# Altium schematic sheet Alimentacion.SchDoc
size A4; SheetNumber: 2
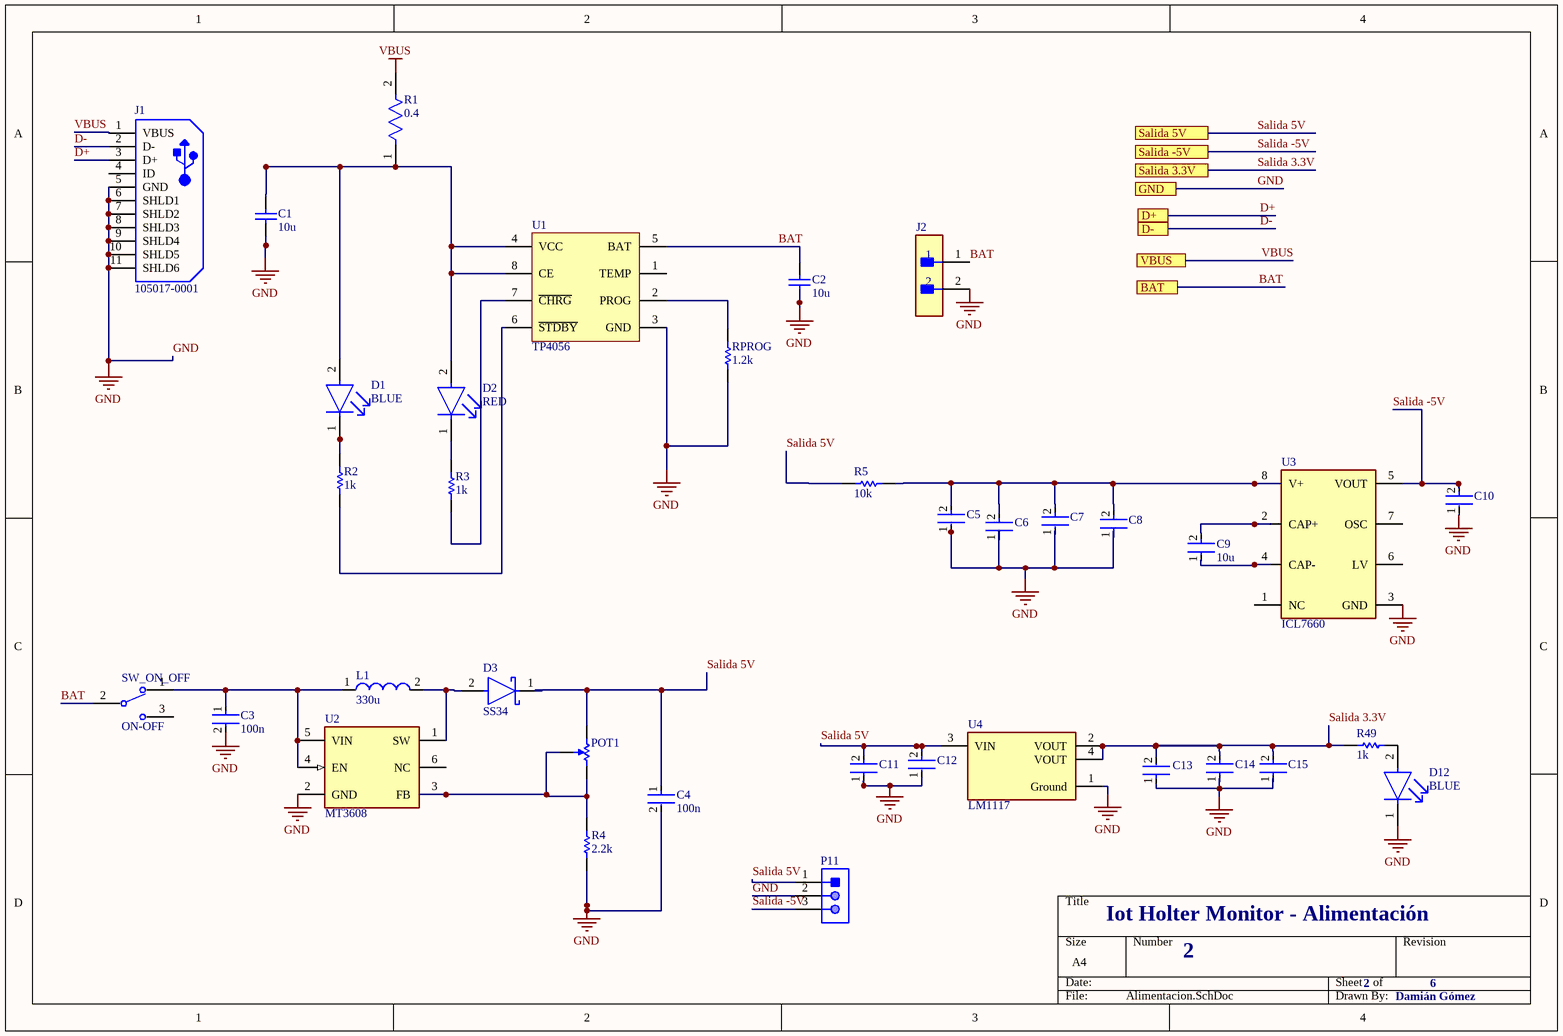
[diagram p0: Alimentacion.SchDoc]

## Parts
C1  10u  [KEMT-1206-2_M]
C2  10u  [CAPC3216X190X55LL30T25]
C3  100n  [FP-CL31-IPC_C]
C4  100n  [FP-CL31-IPC_C]
C5  GRM2165C1H332JA01D  [FP-GRM216-0_1-IPC_B]  (value not drawn)
C6  GRM2165C1H332JA01D  [FP-GRM216-0_1-IPC_B]  (value not drawn)
C7  GRM2165C1H332JA01D  [FP-GRM216-0_1-IPC_B]  (value not drawn)
C8  GRM2165C1H332JA01D  [FP-GRM216-0_1-IPC_B]  (value not drawn)
C9  10u  [FP-GRM216-0_1-IPC_B]
C10  GRM2165C1H332JA01D  [FP-GRM216-0_1-IPC_B]  (value not drawn)
C11  GRM2165C1H332JA01D  [FP-GRM216-0_1-IPC_B]  (value not drawn)
C12  GRM2165C1H332JA01D  [FP-GRM216-0_1-IPC_B]  (value not drawn)
C13  10uF  [FP-CL31-IPC_C]  (value not drawn)
C14  GRM2165C1H332JA01D  [FP-GRM216-0_1-IPC_C]  (value not drawn)
C15  GRM2165C1H332JA01D  [FP-GRM216-0_1-IPC_C]  (value not drawn)
D1  BLUE  [FP-LTST-C191TBKT-MFG]
D2  RED  [FP-LTST-C191TBKT-MFG]
D3  SS34  [FP-95402-MFG]
D12  BLUE  [FP-LTST-C191TBKT-MFG]
J1  105017-0001  [USB-MICRO-B_V]
J2  TSW-102-07-L-S  [FP-TSW-102-07-L-S-MFG]  (value not drawn)
L1  330u  [WE-PD 1050]
P11  640456-3  [TECO-640456-3]  (value not drawn)
POT1  3386P-1-104LF  [BOUR-3386P]  (value not drawn)
R1  0.4  [FP-RC3216-MFG]
R2  1k  [RESC2013X50X30LL20T20]
R3  1k  [RESC2013X50X30LL20T20]
R4  2.2k  [RESC2013X50X30LL20T20]
R5  10k  [RESC2013X50X30LL20T20]
R49  1k  [RESC2013X50X30LL20T20]
RPROG  1.2k  [RESC2013X50X30LL20T20]
SW_ON_OFF  ON-OFF  [FP-1825115-1-MFG]
U1  TP4056  [LT-S8-8_N]
U2  MT3608  [FP-SOT26_SC74R-MFG]
U3  ICL7660  [FP-S8-4-MFG]
U4  LM1117  [FP-AMS1117-IPC_C]

## Ports
BAT, D+, D-, GND, Salida 3.3V, Salida 5V, Salida -5V, VBUS

## Nets
GND: C1.1 C2.1 C3.2 C4.2 C5.1 C6.1 C7.1 C8.1 C10.1 C11.1 C12.1 C13.1 C14.1 C15.1 D12.1(C) J1.5(GND) J1.6(SHLD1) J1.7(SHLD2) J1.8(SHLD3) J1.9(SHLD4) J1.10(SHLD5) J1.11(SHLD6) J2.2 P11.2 R4.1 RPROG.1 U1.3(GND) U2.2(GND) U3.3(GND) U4.1(Ground) ; port GND
VBUS: J1.1(VBUS) R1.2 ; port VBUS
BAT: C2.2 J2.1 SW_ON_OFF.2 U1.5(BAT) ; port BAT
D+: J1.3(D+) ; port D+
D-: J1.2(D-) ; port D-
Salida 3.3V: C13.2 C14.2 C15.2 R49.1 U4.2(VOUT) U4.4(VOUT) ; port Salida 3.3V
Salida 5V: C4.1 C11.2 C12.2 D3.1(C) P11.1 POT1.1 R5.1 U4.3(VIN) ; port Salida 5V
Salida -5V: C10.2 P11.3 U3.5(VOUT) ; port Salida -5V
NetC1_2: C1.2 D1.2(A) D2.2(A) R1.1 U1.4(VCC) U1.8(CE)
NetC3_1: C3.1 L1.1 SW_ON_OFF.1 U2.4(EN) U2.5(VIN)
NetC5_2: C5.2 C6.2 C7.2 C8.2 R5.2 U3.8(V+)
NetC9_1: C9.1 U3.4(CAP-)
NetC9_2: C9.2 U3.2(CAP+)
NetD1_1: D1.1(C) R2.2
NetD2_1: D2.1(C) R3.2
NetD3_2: D3.2(A) L1.2 U2.1(SW)
NetD12_2: D12.2(A) R49.2
NetPOT1_2: POT1.2 POT1.3 R4.2 U2.3(FB)
NetR2_1: R2.1 U1.6(~{STDBY})
NetR3_1: R3.1 U1.7(~{CHRG})
NetRPROG_2: RPROG.2 U1.2(PROG)

Not connected (* = marked no-connect by the designer): J1 4(ID); SW_ON_OFF 3; U1 1(TEMP); U2 6(NC); U3 1(NC) 6(LV) 7(OSC)

## Notes on the sheet
- Iot Holter Monitor - Alimentación
- 2
- 6
- Damián Gómez

## Library data of the parts
C1 = CMP-1037-04202-2: CAP, Ceramic, 0.1 uF, +/- 10%, 50 V, -55 to 125 degC, 1206 (3216 Metric), RoHS, Tape and Reel; Manufacturer: Kemet; Voltage Rating: 50V; Capacitance: 0.1µF; Product Range: KEMET-CSeries; SVHC: ToBeAdvised; Dielectric Characteristic: X7R; Capacitor Case Style: 1206[3216Metric]; Package Reference: 1206-2; Package Description: 2-Leads SMD, Body 3.2 x 1.6 mm; Packaging: Tape&Reel; Operating Temperature Max: 125degC; Capacitance Tolerance: ±10%; Datasheet URL: https://datasheet.ciiva.com/6125/1725438-6125494.pdf; Manufacturer URL: http://www.kemet.com/; Operating Temperature Min: -55degC; Datasheet Version: Jul-13
C2 = CMP-1662-00011-2: Chip Capacitor, 10 uF, +/- 20%, 6.3 V, -55 to 85 degC, 1206 (3216 Metric), RoHS, Tape and Reel; PartNumber: GRM31CR60J107ME39L; Case\/Package: 1206; Capacitance: 100 uF; Voltage Rating (DC): 6.3 V; Type (Capacitors): X5R; REACH SVHC: No SVHC; Height: 1.6 mm; Tolerance: 20%; Packaging: Tape and Reel; Mount: Surface Mount; PackageDescription: 2-Pin Surface Mount Device, Body 3.2 x 1.6 mm; ComponentLink1URL: http://www.murata.com/; Pins: 2; ComponentLink2Description: Datasheet; PackageReference: 1206; Width: 1.6 mm; Package Quantity: 2000; Min Operating Temperature: -55 degC; Case Code (Imperial): 1206; Max Operating Temperature: 85 degC; DatasheetVersion: 09/2016; Mounting Technology: Surface Mount; Voltage Rating: 6.3 V; ComponentLink1Description: Manufacturer URL; Radiation Hardening: No; Case Code (Metric): 3216; Length: 3.2 mm; ComponentLink2URL: http://psearch.en.murata.com/capacitor/product/GRM31CR60J107ME39%23.pdf; RoHSCompliant: true
C3 C4 = CMP-13271-001211-1: Cap Ceramic 100nF 500V C0G ±5% SMD 1206 +125°C Embossed T/R; Capacitance: 220pF; Tolerance: 5%; Voltage Rating (DC): 500V; Depth: 1.6mm; Max Operating Temperature: 125°C; Width: 0.063inch; Radiation Hardening: No; Thickness: 0.055inch; Packaging: Tape and Reel; Height: 1.25mm; Case/Package: 1206; Package Quantity: 10000; Dielectric: C0G; Mount: Surface Mount; Voltage Rating: 500V; Min Operating Temperature: -55°C; Length: 3.2mm
C5-C12 C14 C15 = CMP-2007-00889-2: Chip Multilayer Ceramic Capacitors for General Purpose, 0805, 3300pF, C0G, 30ppm/°C, 5%, 50V; Insulation Resistance: 10GR; Capacitance: 3.3nF; Mount: Surface Mount; Case/Package: 0805; Case Code (Imperial): 0805; Lead Free: Lead Free; RoHS Compliant: Yes; Dielectric: C0G; Material: Ceramic; Size: 0.6mm; Voltage Rating (DC): 50V; Voltage: 50V; Termination: SMD/SMT; Case Code (Metric): 2012; Construction: Flat; Max Operating Temperature: 125°C; Series: GRM; Min Operating Temperature: -55°C; Temperature Coefficient: 30ppm/°C; Packaging: Tape and Reel; Height: 0.6mm; REACH SVHC: No SVHC; Width: 0.049inch; Length: 2mm; Thickness: 0.028inch; Voltage Rating: 50V; Tolerance: 5%; Number of Pins: 2; Package Quantity: 1; Dielectric Material: Ceramic; Depth: 1.25mm
C13 = CMP-13271-001211-1: Cap Ceramic 10uF 500V C0G ±5% SMD 1206 +125°C Embossed T/R; Capacitance: 220pF; Tolerance: 5%; Voltage Rating (DC): 500V; Depth: 1.6mm; Max Operating Temperature: 125°C; Width: 0.063inch; Radiation Hardening: No; Thickness: 0.055inch; Packaging: Tape and Reel; Height: 1.25mm; Case/Package: 1206; Package Quantity: 10000; Dielectric: C0G; Mount: Surface Mount; Voltage Rating: 500V; Min Operating Temperature: -55°C; Length: 3.2mm
D1 D2 D12 = CMP-22017-000008-1: LED BLUE CLEAR CHIP SMD; Lens Color: Colorless; Dominant Wavelength: 475nm; Forward Current: 20mA; Wavelength: 468nm; Viewing Angle: 130°; Power Dissipation: 76mW; Luminous Intensity: 180mcd; Reverse Voltage: 5V; Number of Elements: 1; Lens Style: Diffused; Forward Voltage: 3.8V; Max Power Dissipation: 75mW; Case Code (Metric): 1608; Packaging: Tape and Reel; Case/Package: 0603; Depth: 1.6mm; Mount: Surface Mount; Lead Free: Lead Free; Min Operating Temperature: -20°C; Lens Transparency: Clear; Illumination Color: Blue; Height: 0.55mm; Test Current: 20mA; Case Code (Imperial): 0603; Max Operating Temperature: 80°C; Number of Pins: 2; Length: 0.8mm; Radiation Hardening: No; Package Quantity: 1; Number of LEDs: 1; Width: 0.8mm; Color: Blue
D3 = CMP-02539-000012-1: DIODE SCHOTTKY 40V 3A DO214AB; Manufacturer: Vishay; Manufacturer Part Number: SS34-E3/57T; Max Junction Temp: +150°C; Peak Reverse Current: 0.5mA; Max Surge Forward Current: 100A; Standoff Height: 0mm; ComponentLink2Description: Datasheet; Device Class L3: Schottky Diodes; Height: 2.62mm; Max Repetitive Reverse Voltage: 40V; Lead Free: Yes; Package: 95402; Temperature Range High: +150°C; ComponentLink2URL: http://www.vishay.com/docs/88751/ss32.pdf; Temperature: -55°C to +150°C; Footprint Url: http://www.vishay.com/docs/95402/smc.pdf; Automotive: No; Forward Current: 3A; Category: Diode; RoHS: TRUE; Device Class L2: Diodes; Mouser Description: Schottky Diodes & Rectifiers 3.0 Amp 40 Volt; Octopart: https://octopart.com/ss34-e3%2F57t-vishay-39552907; Temperature Range Low: -55°C; Device Class L1: Discrete Semiconductors; Digikey Description: DIODE SCHOTTKY 40V 3A DO214AB
J1 = CMP-2000-05827-1: Micro-USB B Receptacle, Right Angle, Bottom Mount, Surface Mount, with Solder Tabs, -30 to 85 degC, 5-Pin USB, RoHS, Tape and Reel; Manufacturer: Molex; Featured Product: Micro-USBConnectorsUSBConnectors; Other Names: WM1399DKR; Package Version: Rev. F, 12/2012; Number of Contacts: 5; Connector Type: USB-microB; Catalog Drawings: 1050170001; 3D Model: 105017-0001.stp; Mating Products: WM17145-ND-CABLEMICROUSBBTOSTDA1.0MWM17147-ND-CABLEMICROUSBBTOSTDA2.0MWM17146-ND-CABLEMICROUSBBTOSTDA1.5M; PCN Assembly/Origin: ResinSupplier21/Oct/2015; Voltage - Max: 30V; Online Catalog: Molex-MicroUSB; Manufacturer URL: http://www.molex.com/; Package Description: 5-Leads USB, Micro B, Body 7.5 x 5 mm, Pitch 0.65 mm; Datasheet URL: http://www.molex.com/elqNow/elqRedir.htm?ref=http://www.molex.com/webdocs/datasheets/pdf/en-us/1050170001_IO_CONNECTORS.pdf; Ingress Protection: -; Datasheet Version: 03/2016; Mounting Type: BoardCutout,SurfaceMount,RightAngle; Circuits: 5; Standard Package: 1; Package Reference: MICRO-B; Package URL: http://www.molex.com/pdm_docs/sd/1050170001_sd.pdf; Category: Connectors,Interconnects; Series: -; RoHS Information: 1050170001CertofCompliance; Features: Shielded,SolderRetention; Family: USB,DVI,HDMIConnectors; Specifications: -; Gender: Receptacle; Packaging: Digi-Reel®; Mounting Technology: SurfaceMount
J2 = CMP-02766-001428-1: CONN HEADER VERT 2POS 2.54MM; Voltage Rating: 550V; Current Rating: 7.6A; Gender: Male; Number of Contacts: 2; Connector Type: Male Pin; Radiation Hardening: No; Orientation: Straight; Contact Plating: Gold; Max Operating Temperature: 125°C; Mount: Through Hole; Package Quantity: 1; Number of Rows: 1; Housing Material: Polyester; RoHS Compliant: Yes; Length: 5.08mm; Max Voltage Rating (AC): 550V; Pitch: 2.54mm; Packaging: Bulk; Depth: 2.54mm; Termination: Solder; Min Operating Temperature: -55°C; Housing Color: Black; Lead Free: Lead Free; Color: Black; Number of Positions: 2; Width: 2.54mm; Max Current Rating: 7.6A; REACH SVHC: No SVHC; Contact Material: Bronze; Contact Mating Length: 0.23inch; Series: TSW; Contact Type: Male Pin
L1 = CMP-1396-00019-1: SMD-Shielded Power Inductor WE-PD, L=330 µH; Manufacturer: Wuerth Elektronik; PartNumber: 7447714331; Inductance: 330 ÂµH; PackageReference: WE-PD 1050; ComponentLink1URL: http://www.we-online.com; ComponentLink1Description: Manufacturer URL; ComponentLink2Description: Datasheet; ComponentLink2URL: http://www.we-online.de/katalog/media/pdf/7447714331.pdf
P11 = CMP-2000-05418-1: Male Header, Pitch 2.54 mm, 1 x 3 Position, Height 10.03 mm, Tail Length 3.56 mm, -55 to 105 degC; Manufacturer: TE Connectivity; Agency Approvals: CSA,UL; Angle: Straight; Number of Positions: 3; Standards: RoHSCompliant,ELVCompliant,UL94V-0; Current, Rating: 5 / A; Connector Type: MTA-100; Mount Angle: Vertical; Material, Housing: Polyester; Temperature, Operating: -55to+105 / degC; Voltage, Rating: 250 / V; Color, Housing: White; Contact Centerline Spacing: 0.100 / in.; Special Features: Pinstrip; Material, Contact: CopperAlloy; Contact Termination Area Plating: Tin; Primary Type: InterconnectSystem; Pin Spacing: 0.1 / "; Brand/Series: MTA-100Series; Mounting Hole Size: 0.04 / "; Manufacturer URL: http://www.te.com/; Datasheet URL: https://datasheet.ciiva.com/16456/eng-ds-82056-mta-0608-16456886.pdf; Flammability Rating: UL94V-0; Mounting Type: PCMount; Contact Mating Area Plating: Tin; Datasheet Version: Jun-08; Number of Rows: 1; Termination: Solder; Type: PCBPlug; Length, Pin: 0.14 / "; Color: White; Contact Plating: Tin; Contact Shape: Square; Number of Contacts: 3; Size, Post: 0.025 / in.; Length, Terminal Post: 0.14 / in.; Length, Overall: 0.3 / "
POT1 = CMP-2000-05592-1: Square Trimpot(R) Trimming Potentiometer, 100 KOhm, +/- 10%, 0.5 W, -55 to 125 degC, 3-Pin THD, RoHS, Tube; Manufacturer Series: 3386; Manufacturer: Bourns; Resistive Element Material: Cermet; Shaft Diameter: 3.15mm; Number of Turns: 1; Product Height: 4.83mm; Temperature Coefficient: 100ppm/C; Product Depth: 9.53mm; Rated Temperature (Cel): 85; Actuator Orientation: Vertical; Resistance (ohm): 100000; Power Rating: 1/2W; Tolerance (%): 10; Rated Power Dissipation (P) (W): 0.5; Resistance Law: Linear; Actuator Type: Screw; Operating Temperature-Min (Cel): -55; Manufacturer URL: http://www.bourns.com/; Terminal Finish: TINLEAD; Datasheet Version: 05/2016; Tolerance: 10%; Lead Free: NO; Family: 3386; Product Length: 9.53mm; Mounting: ThroughHole; Packaging: Tube; Package: RectangularPackage; Mounting Feature: ThroughHole; Number of Terminals: 3; Minimum Operating Temperature: -55C; Mounting Technology: ThroughHole; Package Reference: 3386P; Maximum Operating Temperature: 125C; Termination Style: Pin; Datasheet URL: http://www.bourns.com/docs/Product-Datasheets/3386.pdf; Package Description: 3-Pin Through Hole Device, Body 9.53 x 9.53 mm, Pitch 2.54 mm; Product Type: Potentiometer; Operating Temperature-Max (Cel): 125; Resistance Value: 100KOhm; Terminal Shape: WIRE; Technology: Cermet; Type: Trimmer
R1 = CMP-13261-001932-1: Res Thick Film 1206 1kΩ 5% 0.25W ±100ppm/°C Molded SMD T/R; Max Power Dissipation: 250mW; Resistance: 1kR; Voltage Rating (DC): 200V; Width: 0.063inch; Length: 0.126inch; Min Operating Temperature: -55°C; Packaging: Tape and Reel; Case Code (Metric): 3216; Contact Plating: Tin; Composition: Thick Film; Military Standard: Not; Depth: 1.6mm; Lead Free: Lead Free; Height: 0.026inch; Case Code (Imperial): 1206; Number of Terminations: 2; Radiation Hardening: No; Case/Package: 1206; Features: Moisture Resistant; Power Rating: 250mW; Max Operating Temperature: 155°C; Tolerance: 5%; Temperature Coefficient: 100ppm/°C
R2-R5 R49 RPROG = CMP-2001-04896-1: Manufacturer: Vishay Dale; Part Number: CRCW08050000Z0EA
SW_ON_OFF = CMP-03405-000003-1: SWITCH SLIDE SPDT 250MA 125V; Manufacturer Part Number: 1825115-1; Manufacturer: TE Connectivity; Operating Force: 250gf; Electromechanical Life: 6000Cycles; Contact Resistance: 30mΩ; Voltage Rating Dc: 12V; Temperature Range High: +85°C; Temperature: -10°C to +85°C; Package: 1825115-1; Voltage Rating Ac: 125V; Category: Switch; Digikey Description: SWITCH SLIDE SPDT 250MA 125V; Throw Configuration: SPDT; RoHS: TRUE; Mount: Through Hole; Device Class L2: Switches; ComponentLink2Description: Datasheet; Automotive: No; ComponentLink2URL: https://www.te.com/usa-en/product-1825115-1.html?te_bu=Cor&te_type=other&te_campaign=oct_glo_cor-oct-global-oth-prtnr-fy19-oct-octo-buy-bom_sma-298_2&elqCampaignId=35216; Contact Current Rating: 250mA; Temperature Range Low: -10°C; Device Class L3: Slide Switches; Device Class L1: Electromechanical; Octopart: https://octopart.com/sls121pc04-te+connectivity-39426454; Lead Free: Yes
U1 = CMP-0471-00511-1: Standalone Li-Ion Switch Mode Battery Charger, 4.7 to 22 V Vin, 8-pin SOIC (S8-8), -40 to 85 degC, Pb-Free; Manufacturer: Linear Technology; PartNumber: LTC4002ES8-4.2#PBF; Battery Chemistry: Li-Ion, Li-Polymer; Number of Cells: 1; Float Voltage: 4.2 V; Type of Charger: Switching; Charge Termination: On-board timer; Vin Min(V): 4.7; Vin Max(V): 22; ComponentLink3Description: Package Specification; ComponentLink2URL: http://cds.linear.com/docs/en/datasheet/4002f.pdf; Mounting Technology: Surface Mount; ComponentLink3URL: http://cds.linear.com/docs/en/packaging/05081610_G_SO8.pdf; PackageVersion: Rev. G, 03/2012; RoHS: TRUE; PackageReference: S8-8; PackageDescription: 8-Pin Plastic Small Outline (Narrow .150 Inch), Body 4.9 x 3.9 mm, Pitch 1.27 mm; ComponentLink1URL: http://www.linear.com/; ComponentLink2Description: Datasheet; ComponentLink1Description: Manufacturer URL
U2 = CMP-12753-000004-1: IC LED DRIVER RGLTR DIM SOT23-6; Manufacturer Part Number: AP3032KTR-G1; Manufacturer: Diodes Inc.; Max Junction Temp: +150°C; Switching Frequency: 1MHz; Output Voltage: 27V; Min Supply Voltage: 2.7V; Switching Topology: Boost; Number Of Outputs: 1; Max Supply Voltage: 9V; Standoff Height: 0.013mm; Nominal Supply Current: 4mA; Dimming: PWM; Temperature Range High: +85°C; Temperature: -40°C to +85°C; ComponentLink2URL: https://www.diodes.com/assets/Datasheets/AP3032.pdf; Category: IC; Digikey Description: IC LED DRIVER RGLTR DIM SOT23-6; Device Class L1: Integrated Circuits (ICs); Footprint Url: https://www.diodes.com/assets/Package-Files/SOT26-SC74R.pdf; RoHS: TRUE; Device Class L3: LED Drivers; Octopart: https://octopart.com/ap3032ktr-g1-diodes+inc.-30954666; Mouser Description: Voltage Regulators - Switching Regulators White LED Step-Up 1.4A 6.8uH 200mV; Ipc Land Pattern Name: SOT95P280X115-6; Lead Free: Yes; Device Class L2: Power Management ICs; Height: 1.4mm; ComponentLink2Description: Datasheet; Temperature Range Low: -40°C; Package: SOT26 (SC74R); Automotive: No
U3 = CMP-05722-000015-1: IC REG CHARG PUMP INV 20MA 8SOIC; Manufacturer Part Number: ICL7660ESA+; Manufacturer: Maxim Integrated; Standoff Height: 0.1mm; Switching Frequency: 10kHz; Max Supply Voltage: 10V; Min Supply Voltage: 1.5V; Output Voltage: -10/+20V; Output Type: Fixed; Number Of Outputs: 1; Max Power Dissipation: 471mW; Nominal Supply Current: 80uA; Switching Topology: Charge Pump; Negative Voltage Available: true; Automotive: No; Height: 1.75mm; Temperature: -40°C to +85°C; Digikey Description: IC REG CHARG PUMP INV 20MA 8SOIC; ComponentLink2Description: Datasheet; Category: IC; Lead Free: Yes; Output Current: 20mA; Temperature Range High: +85°C; Mouser Description: Switching Voltage Regulators Switched-Capacitor Voltage Converter; ComponentLink2URL: https://datasheets.maximintegrated.com/en/ds/ICL7660-MAX1044.pdf; Device Class L1: Integrated Circuits (ICs); Footprint Url: https://pdfserv.maximintegrated.com/land_patterns/90-0096.PDF; Temperature Range Low: -40°C; Device Class L2: Power Management ICs; RoHS: TRUE; Octopart: https://octopart.com/icl7660esa%2B-maxim+integrated-39427429; Package: S8-4; Device Class L3: Voltage Regulators - Switching
U4 = CMP-209535-000001-1: LDO Voltage Regulators 1A, 3.3V; Manufacturer Part Number: AMS1117-3.3; Manufacturer: Advanced Monolithic Systems; Dropout Voltage: 1.1V; Output Type: Fixed; Nominal Supply Current: 5mA; Max Power Dissipation: 1.2W; Max Supply Voltage: 15V; Number Of Outputs: 1; Standoff Height: 0.64mm; Max Junction Temp: +125°C; Height: 1.8mm; Package: AMS1117; Device Class L2: Power Management ICs; ComponentLink2Description: Datasheet; ComponentLink2URL: http://www.advanced-monolithic.com/pdf/ds1117.pdf; Category: IC; RoHS: TRUE; Automotive: No; Device Class L1: Integrated Circuits (ICs); Output Current: 1A; Device Class L3: Voltage Regulators - Linear; Temperature: -40°C to +125°C; Output Voltage: 3.3V; Temperature Range Low: -40°C; Octopart: https://octopart.com/ams1117-3.3-advanced+monolithic+systems-25899300; Lead Free: Yes; Ipc Land Pattern Name: SOT229P700X180-4; Temperature Range High: +125°C